# EAGLE schematic Power Supply (EAGLE 7.2.0)
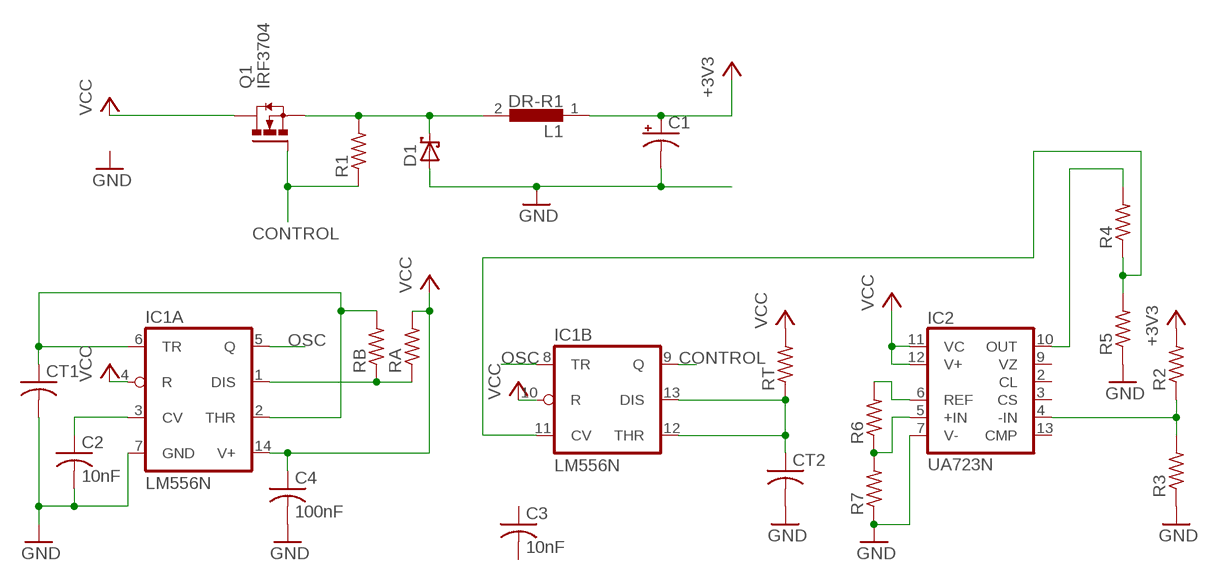
[diagram p0: schematic, sheet 1]

## Parts
C1  CPOL-USE7.5-18  [E7,5-18]
C2  10nF  C-US050-025X075  [C050-025X075]
C3  10nF  C-US050-025X075  [C050-025X075]
C4  100nF  C-US050-025X075  [C050-025X075]
CT1  C-US050-025X075  [C050-025X075]
CT2  C-US050-025X075  [C050-025X075]
D1  SCHOTTKY-DIODEC4111-15  [C4111-15]
IC1  LM556N  [DIL14]
IC2  UA723N  [DIL14]
L1  DR-R1  [DR-R1]
Q1  IRF3704  [TO220AH]
R1  R-US_0207/10  [0207/10]
R2  R-US_0207/10  [0207/10]
R3  R-US_0207/10  [0207/10]
R4  R-US_0207/10  [0207/10]
R5  R-US_0207/10  [0207/10]
R6  R-US_0207/10  [0207/10]
R7  R-US_0207/10  [0207/10]
RA  R-US_0207/10  [0207/10]
RB  R-US_0207/10  [0207/10]
RT  R-US_0207/10  [0207/10]

## Nets
+3V3: C1.+ L1.1 R2.2
CONTROL: IC1.9(B:Q) Q1.B(G) R1.1
GND: C1.- C2.2 C4.2 CT1.2 CT2.2 D1.A IC1.7(A:GND) IC2.7(V-) R3.1 R5.1 R7.1
N$1: D1.C L1.2 Q1.E(S) R1.2
N$2: CT1.1 IC1.2(A:THR) IC1.6(A:TR) RB.2
N$3: IC1.1(A:DIS) RA.1 RB.1
N$4: CT2.1 IC1.12(B:THR) IC1.13(B:DIS) RT.1
N$5: IC2.4(-IN) R2.1 R3.2
N$6: IC2.10(OUT) R4.2
N$7: IC1.11(B:CV) R4.1 R5.2
N$8: C2.1 IC1.3(A:CV)
N$10: IC2.6(REF) R6.2
N$11: IC2.5(+IN) R6.1 R7.2
OSC: IC1.5(A:Q) IC1.8(B:TR)
VCC: C4.1 IC1.4(A:R) IC1.10(B:R) IC1.14(A:V+) IC2.11(VC) IC2.12(V+) Q1.C(D) RA.2 RT.2
Unconnected: C3.1 C3.2 IC2.2(CL) IC2.3(CS) IC2.9(VZ) IC2.13(CMP)

## Library data of the parts
C1 = rcl:CPOL-US: POLARIZED CAPACITOR, American symbol
C2-C4 CT1 CT2 = rcl:C-US: CAPACITOR, American symbol
D1 = diode:SCHOTTKY-DIODE: Schottky Diode
IC1 = linear:*556: Dual TIMER
IC2 = linear:*723: Positive VOLTAGE REGULATOR
L1 = inductors:DR-R1: INDUCTOR
Q1 = transistor-power:IRF3704: SMPS MOSFET HEXFET® Power MOSFET Source: http://www.irf.com/product-info/datasheets/data/irf3704.pdf
R1-R7 RA RB RT = rcl:R-US_: RESISTOR, American symbol